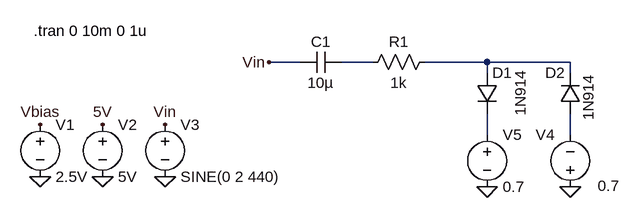
[diagram p0: schematic SimpleFrontEnd.asc]
SimpleFrontEnd.asc, the LTspice schematic file:
Version 4
SHEET 1 964 680
WIRE 352 48 304 48
WIRE 464 48 416 48
WIRE 640 48 544 48
WIRE 768 48 640 48
WIRE 640 64 640 48
WIRE 768 64 768 48
WIRE 640 160 640 128
WIRE 768 160 768 128
FLAG 48 224 0
FLAG 144 224 0
FLAG -48 224 0
FLAG -48 144 Vbias
FLAG 144 144 Vin
FLAG 304 48 Vin
FLAG 48 144 5V
FLAG 640 240 0
FLAG 768 240 0
SYMBOL voltage -48 128 R0
WINDOW 123 0 0 Left 0
WINDOW 39 0 0 Left 0
SYMATTR InstName V1
SYMATTR Value 2.5V
SYMBOL voltage 48 128 R0
WINDOW 123 0 0 Left 0
WINDOW 39 0 0 Left 0
SYMATTR InstName V2
SYMATTR Value 5V
SYMBOL voltage 144 128 R0
WINDOW 123 0 0 Left 0
WINDOW 39 0 0 Left 0
SYMATTR InstName V3
SYMATTR Value SINE(0 2 440)
SYMBOL diode 624 64 R0
WINDOW 3 67 -4 VRight 2
SYMATTR InstName D1
SYMATTR Value 1N914
SYMBOL diode 784 128 R180
WINDOW 0 24 64 Left 2
WINDOW 3 -12 -10 VRight 2
SYMATTR InstName D2
SYMATTR Value 1N914
SYMBOL cap 416 32 R90
WINDOW 0 0 32 VBottom 2
WINDOW 3 32 32 VTop 2
SYMATTR InstName C1
SYMATTR Value 10µ
SYMBOL voltage 768 256 R180
WINDOW 0 24 96 Left 2
WINDOW 3 -76 18 Left 2
WINDOW 123 0 0 Left 0
WINDOW 39 0 0 Left 0
SYMATTR InstName V4
SYMATTR Value 0.7
SYMBOL voltage 640 144 R0
WINDOW 123 0 0 Left 0
WINDOW 39 0 0 Left 0
SYMATTR InstName V5
SYMATTR Value 0.7
SYMBOL res 560 32 R90
WINDOW 0 0 56 VBottom 2
WINDOW 3 32 56 VTop 2
SYMATTR InstName R1
SYMATTR Value 1k
TEXT -58 0 Left 2 !.tran 0 10m 0 1u

The netlist it stands for:
* SimpleFrontEnd.asc
V1 Vbias 0 2.5V
V2 5V 0 5V
V3 Vin 0 SINE(0 2 440)
D1 N002 N003 1N914
D2 N004 N002 1N914
C1 N001 Vin 10µ
V4 0 N004 0.7
V5 N003 0 0.7
R1 N002 N001 1k
.model D D
.lib standard.dio
.tran 0 10m 0 1u
.backanno
.end